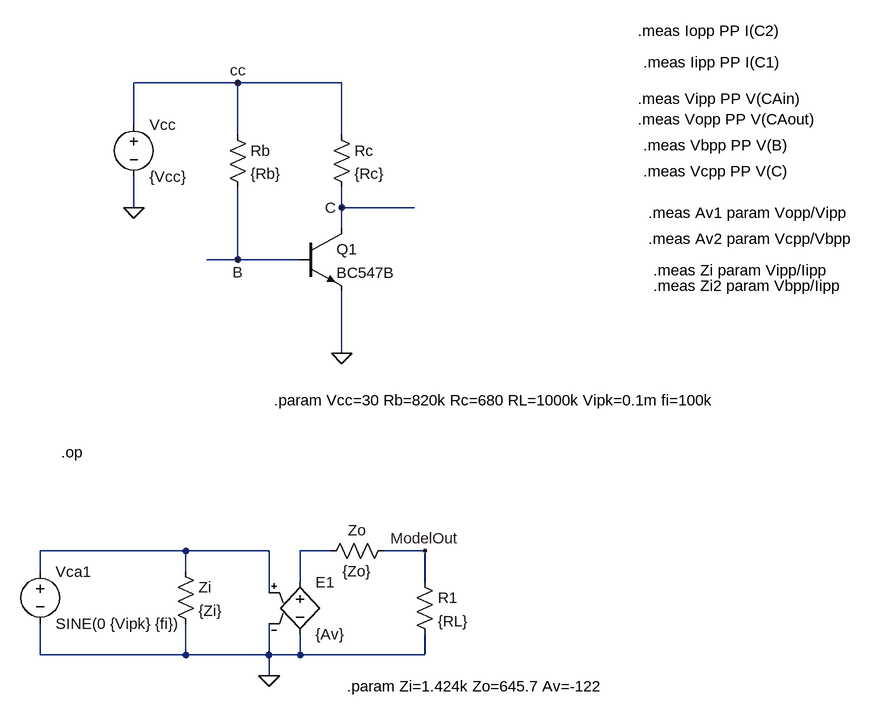
[diagram p0: schematic TBJ01CAop2.asc]
TBJ01CAop2.asc, the LTspice schematic file:
Version 4
SHEET 1 1608 928
WIRE 128 -16 -32 -16
WIRE 288 -16 128 -16
WIRE -32 48 -32 -16
WIRE 128 64 128 -16
WIRE 288 64 288 -16
WIRE -32 176 -32 128
WIRE 288 176 288 144
WIRE 400 176 288 176
WIRE 288 208 288 176
WIRE 128 256 128 144
WIRE 128 256 80 256
WIRE 224 256 128 256
WIRE 288 400 288 304
WIRE 48 704 -176 704
WIRE 176 704 48 704
WIRE 272 704 224 704
WIRE 416 704 352 704
WIRE -176 736 -176 704
WIRE 48 736 48 704
WIRE 224 752 224 704
WIRE 416 752 416 704
WIRE 176 768 176 704
WIRE -176 864 -176 816
WIRE 48 864 48 816
WIRE 48 864 -176 864
WIRE 176 864 176 816
WIRE 176 864 48 864
WIRE 224 864 224 832
WIRE 224 864 176 864
WIRE 416 864 416 832
WIRE 416 864 224 864
WIRE 176 896 176 864
FLAG -32 176 0
FLAG 288 400 0
FLAG 128 -16 cc
FLAG 128 256 B
FLAG 288 176 C
FLAG 176 896 0
FLAG 416 704 ModelOut
SYMBOL res 112 48 R0
SYMATTR InstName Rb
SYMATTR Value {Rb}
SYMBOL res 272 48 R0
SYMATTR InstName Rc
SYMATTR Value {Rc}
SYMBOL voltage -32 32 R0
WINDOW 123 0 0 Left 0
WINDOW 39 0 0 Left 0
SYMATTR InstName Vcc
SYMATTR Value {Vcc}
SYMBOL npn 224 208 R0
SYMATTR InstName Q1
SYMATTR Value BC547B
SYMBOL res 32 720 R0
SYMATTR InstName Zi
SYMATTR Value {Zi}
SYMBOL res 368 688 R90
WINDOW 0 0 56 VBottom 2
WINDOW 3 32 56 VTop 2
SYMATTR InstName Zo
SYMATTR Value {Zo}
SYMBOL e 224 736 R0
SYMATTR InstName E1
SYMATTR Value {Av}
SYMBOL res 400 736 R0
SYMATTR InstName R1
SYMATTR Value {RL}
SYMBOL voltage -176 720 R0
WINDOW 123 0 0 Left 0
WINDOW 39 0 0 Left 0
SYMATTR InstName Vca1
SYMATTR Value SINE(0 {Vipk} {fi})
TEXT 744 8 Left 2 !.meas Vipp PP V(CAin)
TEXT 744 40 Left 2 !.meas Vopp PP V(CAout)
TEXT 752 80 Left 2 !.meas Vbpp PP V(B)
TEXT 752 120 Left 2 !.meas Vcpp PP V(C)
TEXT 760 184 Left 2 !.meas Av1 param Vopp/Vipp
TEXT 760 224 Left 2 !.meas Av2 param Vcpp/Vbpp
TEXT 752 -48 Left 2 !.meas Iipp PP I(C1)
TEXT 768 272 Left 2 !.meas Zi param Vipp/Iipp
TEXT 744 -96 Left 2 !.meas Iopp PP I(C2)
TEXT 768 296 Left 2 !.meas Zi2 param Vbpp/Iipp
TEXT 184 472 Left 2 !.param Vcc=30 Rb=820k Rc=680 RL=1000k Vipk=0.1m fi=100k
TEXT 296 912 Left 2 !.param Zi=1.424k Zo=645.7 Av=-122
TEXT -144 552 Left 2 !.op

The netlist it stands for:
* TBJ01CAop2.asc
Rb cc B {Rb}
Rc cc C {Rc}
Vcc cc 0 {Vcc}
Q1 C B 0 0 BC547B
R§Zi N001 0 {Zi}
R§Zo ModelOut N002 {Zo}
E1 N002 0 N001 0 {Av}
R1 ModelOut 0 {RL}
Vca1 N001 0 SINE(0 {Vipk} {fi})
.model NPN NPN
.model PNP PNP
.lib standard.bjt
.meas Vipp PP V(CAin)
.meas Vopp PP V(CAout)
.meas Vbpp PP V(B)
.meas Vcpp PP V(C)
.meas Av1 param Vopp/Vipp
.meas Av2 param Vcpp/Vbpp
.meas Iipp PP I(C1)
.meas Zi param Vipp/Iipp
.meas Iopp PP I(C2)
.meas Zi2 param Vbpp/Iipp
.param Vcc=30 Rb=820k Rc=680 RL=1000k Vipk=0.1m fi=100k
.param Zi=1.424k Zo=645.7 Av=-122
.op
.backanno
.end